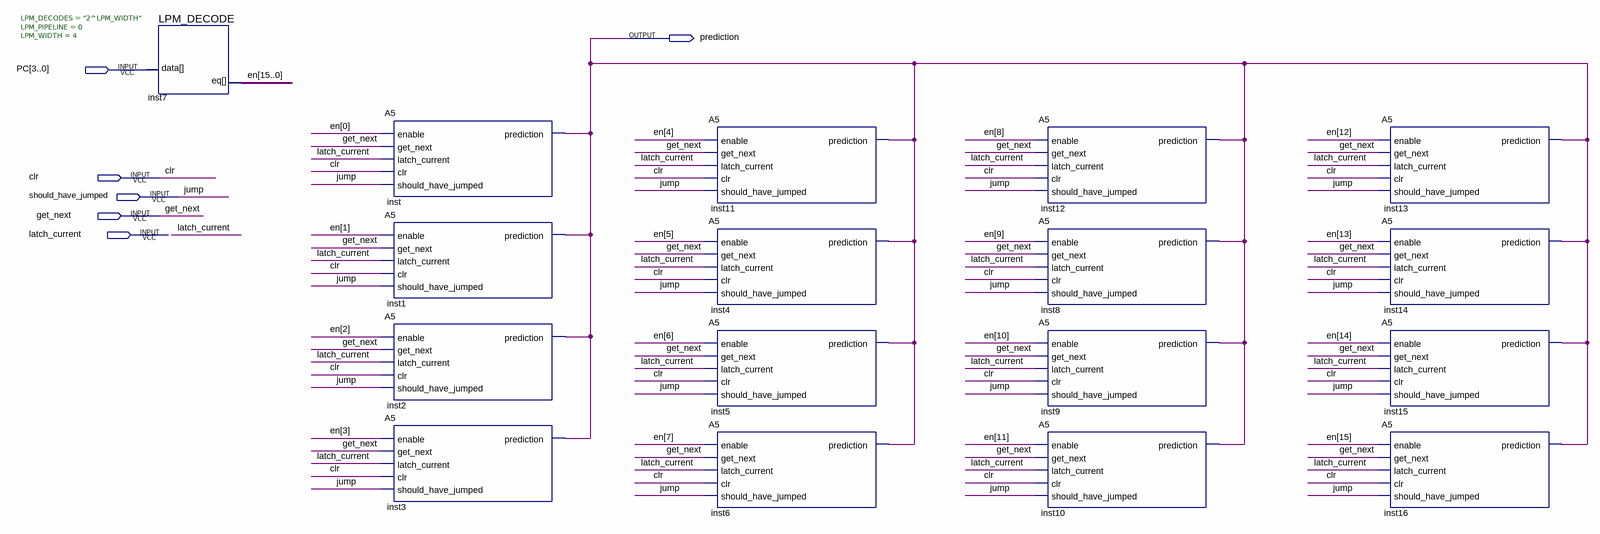
[diagram p0: schematic sheet]
// Quartus schematic PHT.bdf as structural Verilog: 17 symbols, 6 pins
module PHT (
  input  [3:0] PC,
  input  clr,
  input  should_have_jumped,
  input  get_next,
  input  latch_current,
  output prediction
);

  wire [15:0] en;

  LPM_DECODE #(.LPM_DECODES("2^LPM_WIDTH"), .LPM_PIPELINE(0), .LPM_WIDTH(4)) inst7 (.data(PC), .eq(en));
  A5 inst (
    .enable(en[0]), .get_next(get_next), .latch_current(latch_current), .clr(clr),
    .should_have_jumped(should_have_jumped), .prediction(prediction));
  A5 inst1 (
    .enable(en[1]), .get_next(get_next), .latch_current(latch_current), .clr(clr),
    .should_have_jumped(should_have_jumped), .prediction(prediction));
  A5 inst2 (
    .enable(en[2]), .get_next(get_next), .latch_current(latch_current), .clr(clr),
    .should_have_jumped(should_have_jumped), .prediction(prediction));
  A5 inst3 (
    .enable(en[3]), .get_next(get_next), .latch_current(latch_current), .clr(clr),
    .should_have_jumped(should_have_jumped), .prediction(prediction));
  A5 inst11 (
    .enable(en[4]), .get_next(get_next), .latch_current(latch_current), .clr(clr),
    .should_have_jumped(should_have_jumped), .prediction(prediction));
  A5 inst4 (
    .enable(en[5]), .get_next(get_next), .latch_current(latch_current), .clr(clr),
    .should_have_jumped(should_have_jumped), .prediction(prediction));
  A5 inst5 (
    .enable(en[6]), .get_next(get_next), .latch_current(latch_current), .clr(clr),
    .should_have_jumped(should_have_jumped), .prediction(prediction));
  A5 inst6 (
    .enable(en[7]), .get_next(get_next), .latch_current(latch_current), .clr(clr),
    .should_have_jumped(should_have_jumped), .prediction(prediction));
  A5 inst12 (
    .enable(en[8]), .get_next(get_next), .latch_current(latch_current), .clr(clr),
    .should_have_jumped(should_have_jumped), .prediction(prediction));
  A5 inst8 (
    .enable(en[9]), .get_next(get_next), .latch_current(latch_current), .clr(clr),
    .should_have_jumped(should_have_jumped), .prediction(prediction));
  A5 inst9 (
    .enable(en[10]), .get_next(get_next), .latch_current(latch_current), .clr(clr),
    .should_have_jumped(should_have_jumped), .prediction(prediction));
  A5 inst10 (
    .enable(en[11]), .get_next(get_next), .latch_current(latch_current), .clr(clr),
    .should_have_jumped(should_have_jumped), .prediction(prediction));
  A5 inst13 (
    .enable(en[12]), .get_next(get_next), .latch_current(latch_current), .clr(clr),
    .should_have_jumped(should_have_jumped), .prediction(prediction));
  A5 inst14 (
    .enable(en[13]), .get_next(get_next), .latch_current(latch_current), .clr(clr),
    .should_have_jumped(should_have_jumped), .prediction(prediction));
  A5 inst15 (
    .enable(en[14]), .get_next(get_next), .latch_current(latch_current), .clr(clr),
    .should_have_jumped(should_have_jumped), .prediction(prediction));
  A5 inst16 (
    .enable(en[15]), .get_next(get_next), .latch_current(latch_current), .clr(clr),
    .should_have_jumped(should_have_jumped), .prediction(prediction));

  // Other names for the same wires on the sheet: jump = should_have_jumped
endmodule
